# Altium schematic sheet arduino_Uno_Rev3-02-TH_2022-03-31.schdoc
size 367 x 271 mm
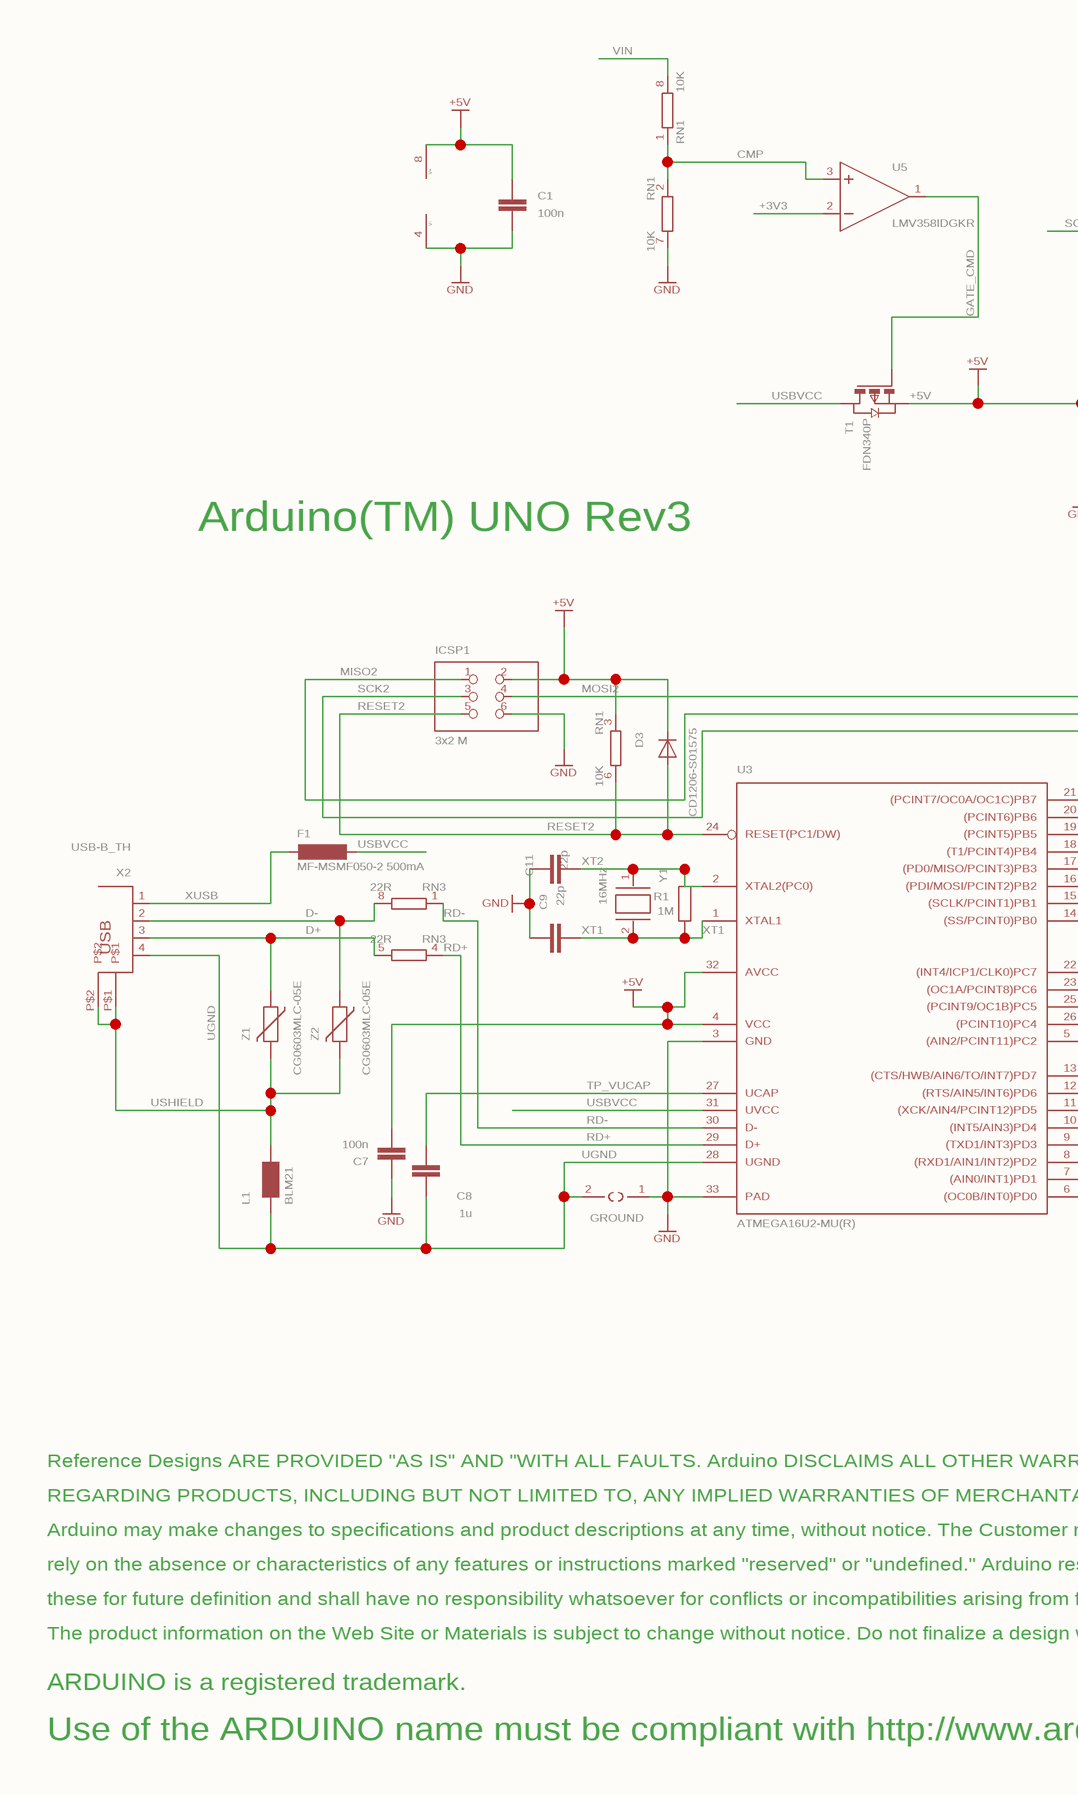
[diagram p0: arduino_Uno_Rev3-02-TH_2022-03-31.schdoc, left]
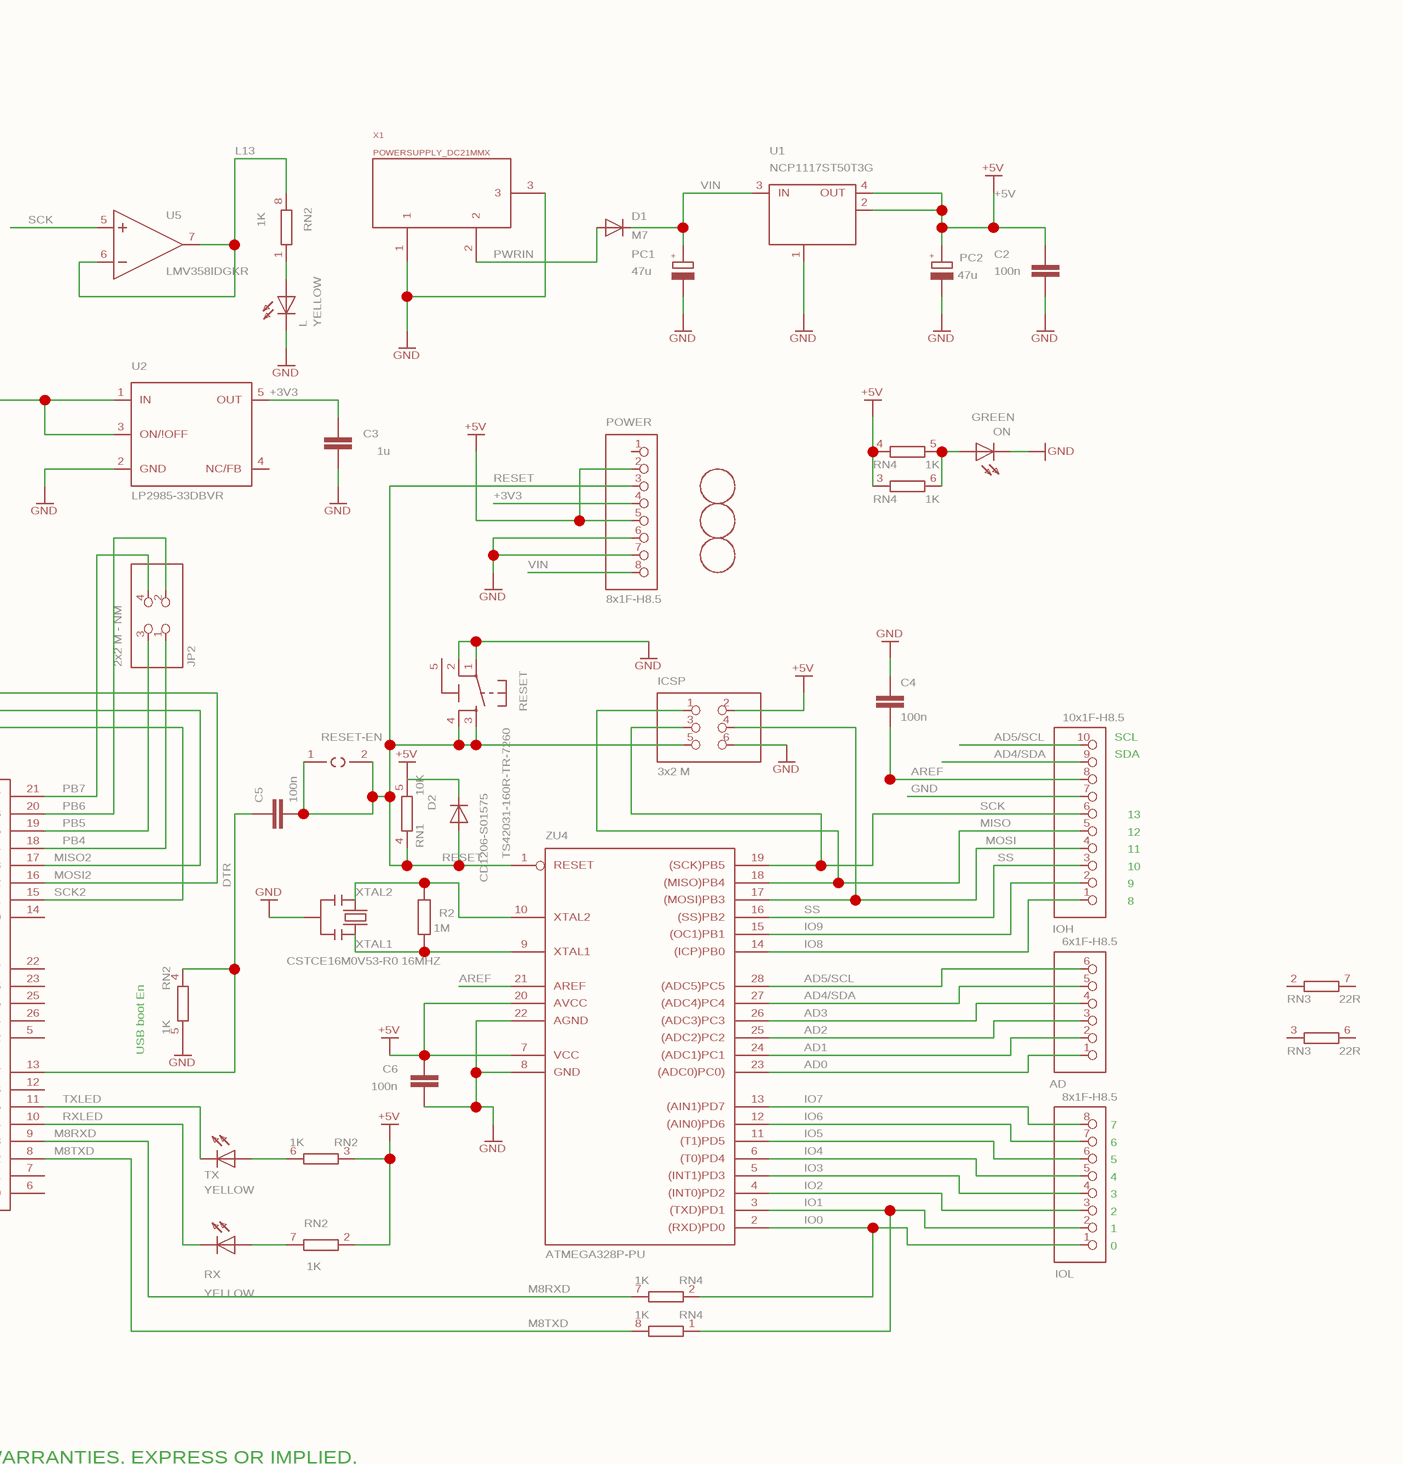
[diagram p1: arduino_Uno_Rev3-02-TH_2022-03-31.schdoc, right]

## Parts
(Parts that share a designator on the sheet are numbered #1, #2 ... from top to bottom, then left to right.)
AD  6x1F-H8.5  [1X06]
C1  100n  [C0603-ROUND]
C2  100n  [C0603-ROUND]
C3  1u  [C0603-ROUND]
C4  100n  [C0603-ROUND]
C5  100n  [C0603-ROUND]
C6  100n  [C0603-ROUND]
C7  100n  [C0603-ROUND]
C8  1u  [C0603-ROUND]
C9  22p  [C0603-ROUND]
C11  22p  [C0603-ROUND]
D1  M7  [SMB]
D2  CD1206-S01575  [MINIMELF]
D3  CD1206-S01575  [MINIMELF]
F1  MF-MSMF050-2 500mA  [L1812]
FD1  FIDUCIALMOUNT  [FIDUCIA-MOUNT]  (value not drawn)
FD2  FIDUCIALMOUNT  [FIDUCIA-MOUNT]  (value not drawn)
FD3  FIDUCIALMOUNT  [FIDUCIA-MOUNT]  (value not drawn)
GROUND  SJ  [SJ]  (value not drawn)
ICSP  3x2 M  [2X03]
ICSP1  3x2 M  [2X03]
IOH  10x1F-H8.5  [1X10]
IOL  8x1F-H8.5  [1X08]
JP2  2x2 M - NM  [2X02]
L  YELLOW  [CHIP-LED0805]
L1  BLM21  [0805]
ON  GREEN  [CHIP-LED0805]
PC1  47u  [PANASONIC_D]
PC2  47u  [PANASONIC_D]
POWER  8x1F-H8.5  [1X08]
R1  1M  [R0603-ROUND]
R2  1M  [R0603-ROUND]
RESET  TS42031-160R-TR-7260  [TS42]
RESET-EN  SJ  [SJ]  (value not drawn)
RN1#1  10K  [CAY16]
RN1#2  10K  [CAY16]
RN1#3  10K  [CAY16]
RN1#4  10K  [CAY16]
RN2#1  1K  [CAY16]
RN2#2  1K  [CAY16]
RN2#3  1K  [CAY16]
RN2#4  1K  [CAY16]
RN3#1  22R  [CAY16]
RN3#2  22R  [CAY16]
RN3#3  22R  [CAY16]
RN3#4  22R  [CAY16]
RN4#1  1K  [CAY16]
RN4#2  1K  [CAY16]
RN4#3  1K  [CAY16]
RN4#4  1K  [CAY16]
RX  YELLOW  [CHIP-LED0805]
T1  FDN340P  [SOT-23]
TX  YELLOW  [CHIP-LED0805]
U1  NCP1117ST50T3G  [SOT223]
U2  LP2985-33DBVR  [SOT23-DBV]
U3  ATMEGA16U2-MU(R)  [MLF32]
U5#1  LMV358IDGKR  [MSOP08]  (value not drawn)
U5#2  LMV358IDGKR  [MSOP08]
U5#3  LMV358IDGKR  [MSOP08]
U$1  DISCLAIMER  [DISCLAIMER]  (value not drawn)
X1  POWERSUPPLY_DC21MMX  [POWERSUPPLY_DC-21MM]
X2  USB-B_TH  [PN61729]
Y1  16MHz  [QS]
Y2  CSTCE16M0V53-R0 16MHZ  [RESONATOR]
Z1  CG0603MLC-05E  [CT/CN0603]
Z2  CG0603MLC-05E  [CT/CN0603]
ZU4  ATMEGA328P-PU  [DIL28-3]

## Nets
+5V: C1.2 C2.2 C6.2 C7.1 D2.C D3.C ICSP.2 ICSP1.2 PC2.+ POWER.2 POWER.5 RN1#3.3 RN1#4.5 RN2#3.3 RN2#4.2 RN4#1.4 RN4#2.3 T1.2(S) U1.2(OUT) U1.4(OUT) U2.1(IN) U2.3(ON/!OFF) U3.4(VCC) U3.32(AVCC) U5#1.8(V+) ZU4.7(VCC) ZU4.20(AVCC)
GND: C1.1 C2.1 C3.1 C4.1 C6.1 C7.2 C9.2 C11.2 GROUND.1 ICSP.6 ICSP1.6 IOH.7 L.C ON.C PC1.- PC2.- POWER.6 POWER.7 RESET.1 RESET.2 RN1#2.7 RN2#2.5 U1.1(GND/ADJ) U2.2(GND) U3.3(GND) U3.33(PAD) U5#1.4(V-) X1.1 X1.3 Y2.2 ZU4.8(GND) ZU4.22(AGND)
+3V3: C3.2 POWER.4 U2.5(OUT) U5#2.2(-IN)
AD0: AD.1 ZU4.23((ADC0)PC0))
AD1: AD.2 ZU4.24((ADC1)PC1)
AD2: AD.3 ZU4.25((ADC2)PC2)
AD3: AD.4 ZU4.26((ADC3)PC3)
AD4/SDA: AD.5 IOH.9 ZU4.27((ADC4)PC4)
AD5/SCL: AD.6 IOH.10 ZU4.28((ADC5)PC5)
AREF: C4.2 IOH.8 ZU4.21(AREF)
CMP: RN1#1.1 RN1#2.2 U5#2.3(+IN)
D+: RN3#2.5 X2.3 Z1.1
D-: RN3#1.8 X2.2 Z2.1
DTR: C5.1 RN2#2.4 U3.13((CTS/HWB/AIN6/TO/INT7)PD7)
GATE_CMD: T1.3(G) U5#2.1(OUT)
IO0: IOL.1 RN4#3.2 ZU4.2((RXD)PD0)
IO1: IOL.2 RN4#4.1 ZU4.3((TXD)PD1)
IO2: IOL.3 ZU4.4((INT0)PD2)
IO3: IOL.4 ZU4.5((INT1)PD3)
IO4: IOL.5 ZU4.6((T0)PD4)
IO5: IOL.6 ZU4.11((T1)PD5)
IO6: IOL.7 ZU4.12((AIN0)PD6)
IO7: IOL.8 ZU4.13((AIN1)PD7)
IO8: IOH.1 ZU4.14((ICP)PB0)
IO9: IOH.2 ZU4.15((OC1)PB1)
L13: RN2#1.8 U5#3.6(-IN) U5#3.7(OUT)
M8RXD: RN4#3.7 U3.9((TXD1/INT3)PD3)
M8TXD: RN4#4.8 U3.8((RXD1/AIN1/INT2)PD2)
MISO: ICSP.1 IOH.5 ZU4.18((MISO)PB4)
MISO2: ICSP1.1 U3.17((PD0/MISO/PCINT3)PB3)
MOSI: ICSP.4 IOH.4 ZU4.17((MOSI)PB3)
MOSI2: ICSP1.4 U3.16((PDI/MOSI/PCINT2)PB2)
PB4: JP2.1 U3.18((T1/PCINT4)PB4)
PB5: JP2.3 U3.19((PCINT5)PB5)
PB6: JP2.2 U3.20((PCINT6)PB6)
PB7: JP2.4 U3.21((PCINT7/OC0A/OC1C)PB7)
PWRIN: D1.A X1.2
RD+: RN3#2.4 U3.29(D+)
RD-: RN3#1.1 U3.30(D-)
RESET: C5.2 D2.A ICSP.5 POWER.3 RESET.3 RESET.4 RESET-EN.1 RESET-EN.2 RN1#4.4 ZU4.1(RESET)
RESET2: D3.A ICSP1.5 RN1#3.6 U3.24(RESET(PC1/DW))
RXLED: RX.C U3.10((INT5/AIN3)PD4)
SCK: ICSP.3 IOH.6 U5#3.5(+IN) ZU4.19((SCK)PB5)
SCK2: ICSP1.3 U3.15((SCLK/PCINT1)PB1)
SS: IOH.3 ZU4.16((SS)PB2)
TP_VUCAP: C8.1 U3.27(UCAP)
TXLED: TX.C U3.11((XCK/AIN4/PCINT12)PD5)
UGND: C8.2 GROUND.2 L1.1 U3.28(UGND) X2.4
USBVCC: F1.1 T1.1(D) U3.31(UVCC)
USHIELD: L1.2 X2.P$1 X2.P$2 Z1.2 Z2.2
VIN: D1.C PC1.+ POWER.8 RN1#1.8 U1.3(IN)
XT1: C9.1 R1.1 U3.1(XTAL1) Y1.2
XT2: C11.1 R1.2 U3.2(XTAL2(PC0)) Y1.1
XTAL1: R2.1 Y2.3 ZU4.9(XTAL1)
XTAL2: R2.2 Y2.1 ZU4.10(XTAL2)
XUSB: F1.2 X2.1
NetL_A: L.A RN2#1.1
NetON_A: ON.A RN4#1.5 RN4#2.6
NetRN2#3_6: RN2#3.6 TX.A
NetRN2#4_7: RN2#4.7 RX.A

Not connected (* = marked no-connect by the designer): POWER 1; RESET 5(5-GND); RN3#3 2(1) 7(2); RN3#4 3(1) 6(2); U2 4(NC/FB); U3 5((AIN2/PCINT11)PC2) 6((OC0B/INT0)PD0) 7((AIN0/INT1)PD1) 12((RTS/AIN5/INT6)PD6) 14((SS/PCINT0)PB0) 22((INT4/ICP1/CLK0)PC7) 23((OC1A/PCINT8)PC6) 25((PCINT9/OC1B)PC5) 26((PCINT10)PC4)

## Notes on the sheet
- Arduino(TM) UNO Rev3
- (near IOH) SDA
- (near IOH) SCL
- (near IOH) 9
- (near IOH) 10
- (near IOH) 11
- (near IOH) 12
- (near IOH) 13
- (near IOH) 8
- (near RN2#2) USB boot En
- (near IOL) 5
- (near IOL) 6
- (near IOL) 7
- (near IOL) 1
- (near IOL) 2
- (near IOL) 3
- (near IOL) 4
- (near IOL) 0
- (near U$1) Use of the ARDUINO name must be compliant with http://www.arduino.cc/en/Main/Policy
- (in symbol DISCLAIMER) Reference Designs ARE PROVIDED "AS IS" AND "WITH ALL FAULTS. Arduino DISCLAIMS ALL OTHER WARRANTIES, EXPRESS OR IMPLIED,; REGARDING PRODUCTS, INCLUDING BUT NOT LIMITED TO, ANY IMPLIED WARRANTIES OF MERCHANTABILITY OR FITNESS FOR A PARTICULAR PURPOSE; Arduino may make changes to specifications and product descriptions at any time, without notice. The Customer must not; rely on the absence or characteristics of any features or instructions marked "reserved" or "undefined." Arduino reserves; these for future definition and shall have no responsibility whatsoever for conflicts or incompatibilities arising from future changes to them.; The product information on the Web Site or Materials is subject to change without notice. Do not finalize a design with this information.; ARDUINO is a registered trademark.
- (in symbol USB-B_TH) USB